# Altium schematic sheet BT8670.SchDoc: BULLSEYE
size A3; CompanyName: TYMPHANY; DrawnBy: Yetta.He; Organization: PABU; Address1: 11F,block A, CEC building,; Address2: No.2070 Shennan Zhong road,; Address3: Huaqiang North, Futian District,; Address4: Shenzhen,  Guang Dong, P.R.C 518000; DocumentNumber: 6; Revision: 0.0.5; SheetNumber: 6; SheetTotal: 7; Size: A3; Status: DP1
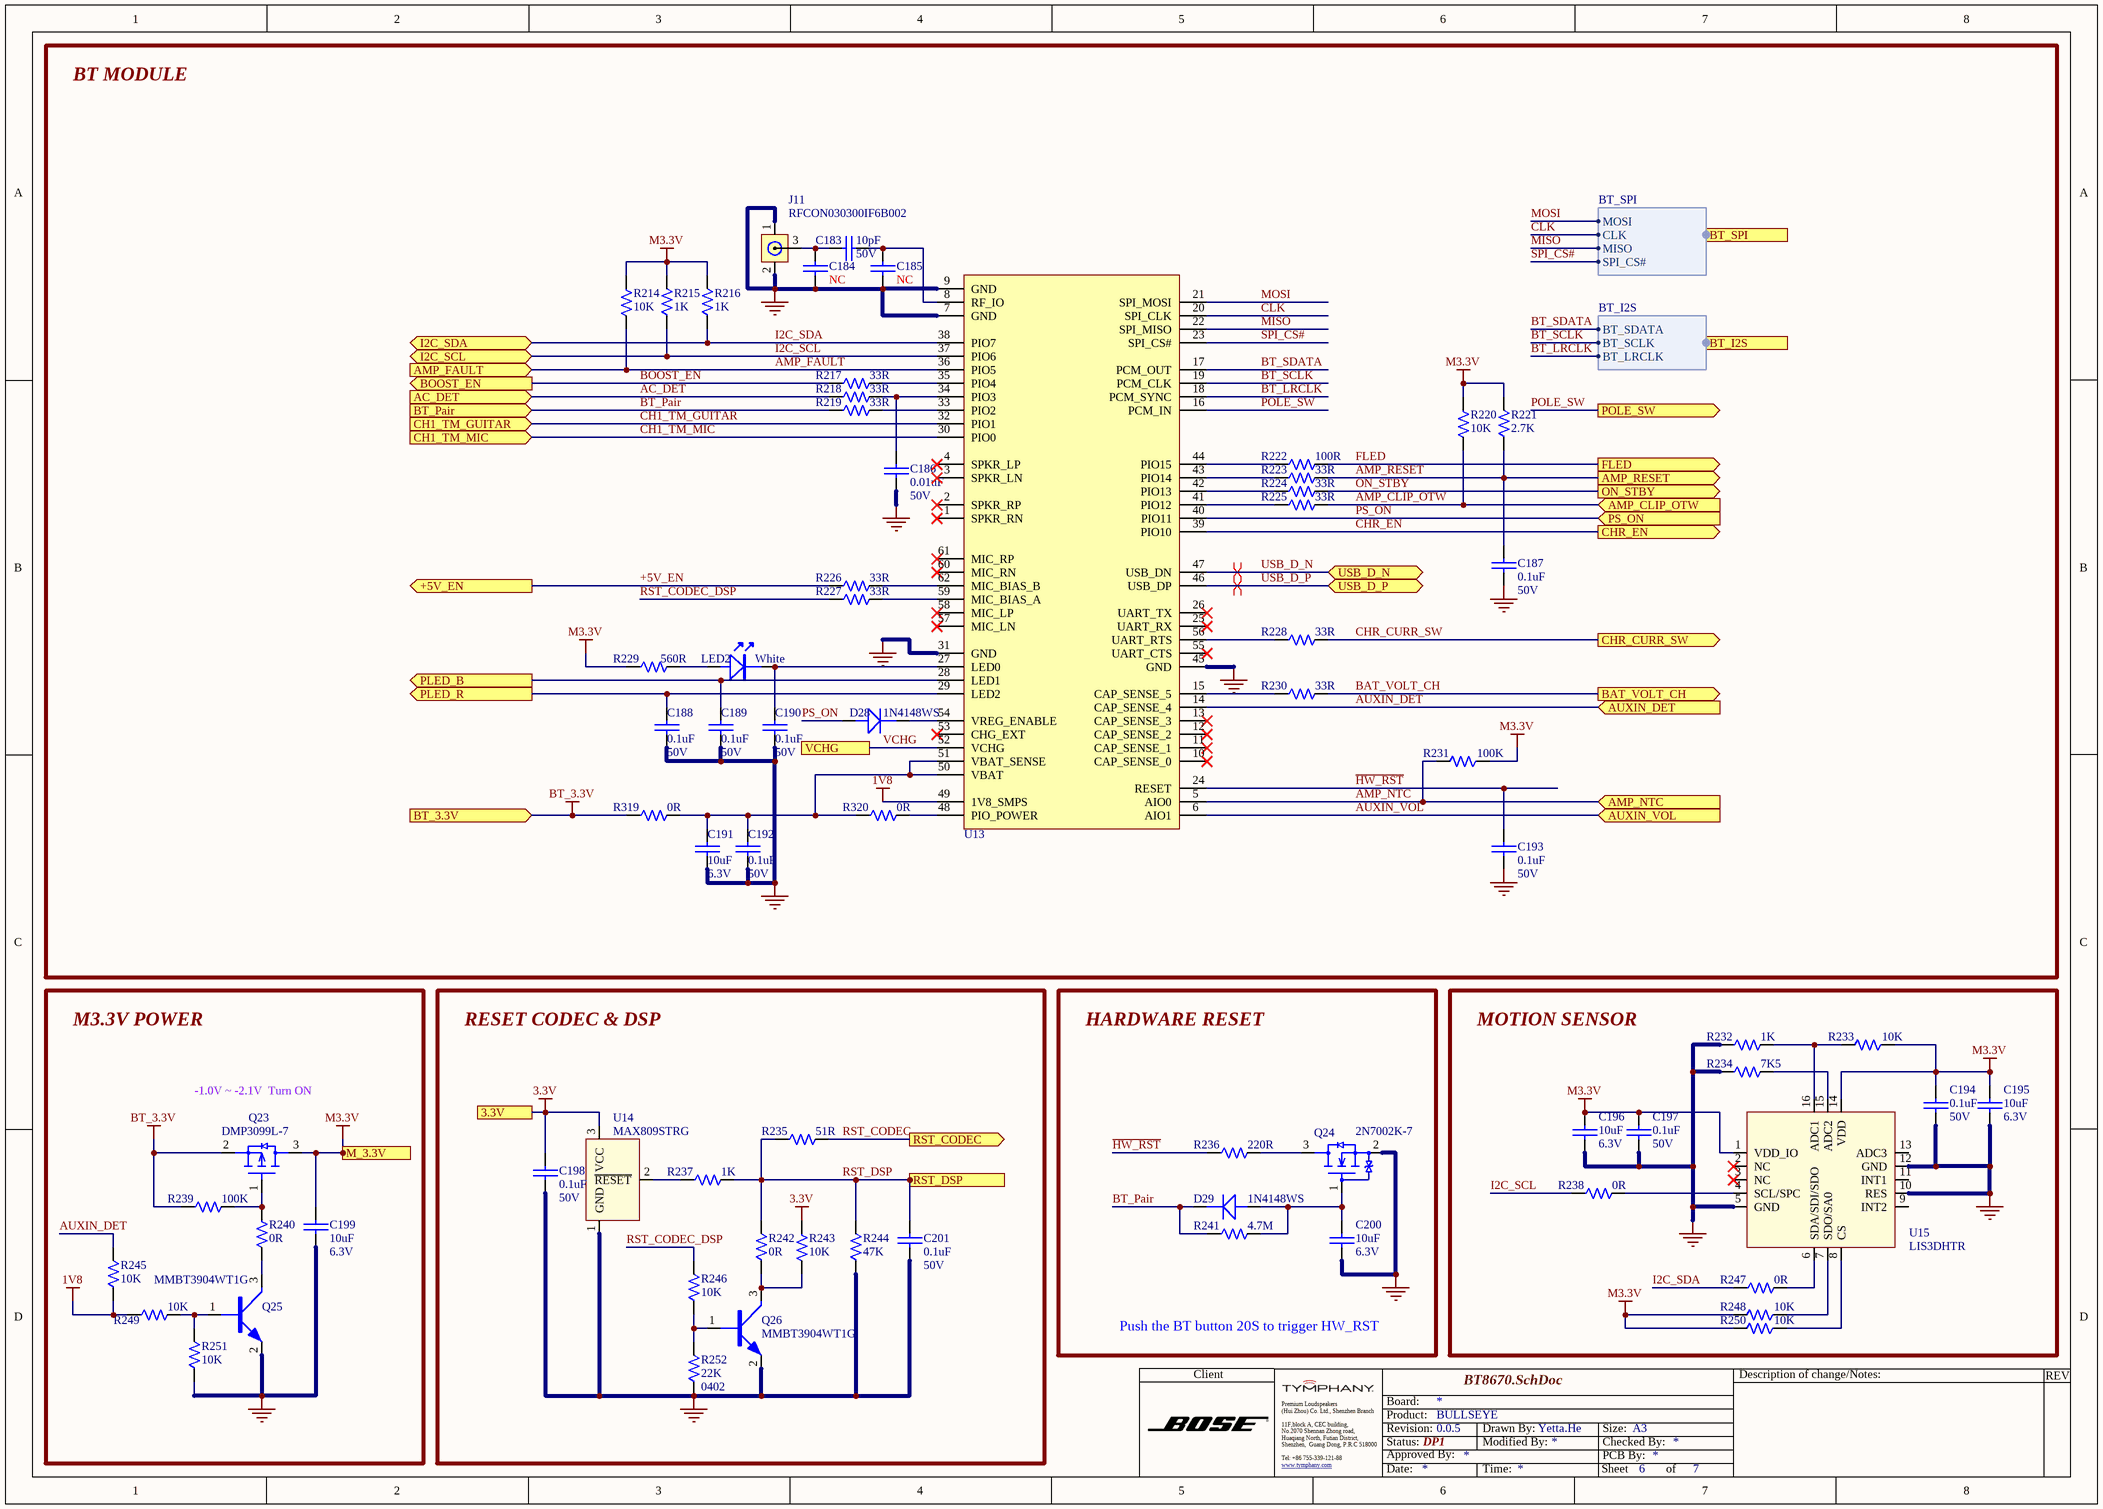
[diagram p0: BT8670.SchDoc]

## Parts
C183  value 10pF  Voltage: 50V  [CAPC0402-RW]  (hidden comment: PWL410371-1000)
C184  value NC  [CAPC0402-RW]  (hidden comment: CAP0402 NC)
C185  value NC  [CAPC0402-RW]  (hidden comment: CAP0402 NC)
C186  value 0.01uF  Voltage: 50V  [CAPC0402-RW]  (hidden comment: PWL456470-1030)
C187  value 0.1uF  Voltage: 50V  [CAPC0402-RW]  (hidden comment: PWL456470-1040)
C188  value 0.1uF  Voltage: 50V  [CAPC0402-RW]  (hidden comment: PWL456470-1040)
C189  value 0.1uF  Voltage: 50V  [CAPC0402-RW]  (hidden comment: PWL456470-1040)
C190  value 0.1uF  Voltage: 50V  [CAPC0402-RW]  (hidden comment: PWL456470-1040)
C191  value 10uF  Voltage: 6.3V  [CAPC0603-RW]  (hidden comment: T54502106710E)
C192  value 0.1uF  Voltage: 50V  [CAPC0402-RW]  (hidden comment: PWL456470-1040)
C193  value 0.1uF  Voltage: 50V  [CAPC0402-RW]  (hidden comment: PWL456470-1040)
C194  value 0.1uF  Voltage: 50V  [CAPC0402-RW]  (hidden comment: PWL456470-1040)
C195  value 10uF  Voltage: 6.3V  [CAPC0603-RW]  (hidden comment: T54502106710E)
C196  value 10uF  Voltage: 6.3V  [CAPC0603-RW]  (hidden comment: T54502106710E)
C197  value 0.1uF  Voltage: 50V  [CAPC0402-RW]  (hidden comment: PWL456470-1040)
C198  value 0.1uF  Voltage: 50V  [CAPC0402-RW]  (hidden comment: PWL456470-1040)
C199  value 10uF  Voltage: 6.3V  [CAPC0603-RW]  (hidden comment: T54502106710E)
C200  value 10uF  Voltage: 6.3V  [CAPC0603-RW]  (hidden comment: T54502106710E)
C201  value 0.1uF  Voltage: 50V  [CAPC0402-RW]  (hidden comment: PWL456470-1040)
D28  RCD114148-0020  [SOD-323]  (value not drawn)
D29  RCD114148-0020  [SOD-323]  (value not drawn)
J11  MFG Part: RFCON030300IF6B002  [RF IPEXSOCKET RFCON030300IF6B00]  (hidden comment: T690300090900)
LED2  Color: White  [LED0603_WHITE]  (hidden comment: T575006150202)
Q23  T585002550438  [SOT23-132-RW]  (value not drawn)
Q24  T586003230438  [SOT23-132-RW]  (value not drawn)
Q25  T581004222440  [SOT323(SC-70)-R]  (value not drawn)
Q26  T581004222440  [SOT323(SC-70)-R]  (value not drawn)
R214  value 10K  [0402-RW]  (hidden comment: QCF161240-1002)
R215  value 1K  [0402-RW]  (hidden comment: QCF161240-1001)
R216  value 1K  [0402-RW]  (hidden comment: QCF161240-1001)
R217  value 33R  [0402-RW]  (hidden comment: QCF161241-3309)
R218  value 33R  [0402-RW]  (hidden comment: QCF161241-3309)
R219  value 33R  [0402-RW]  (hidden comment: QCF161241-3309)
R220  value 10K  [0402-RW]  (hidden comment: QCF161240-1002)
R221  value 2.7K  [0402-RW]  (hidden comment: QCF161240-2701)
R222  value 100R  [0603-RW]  (hidden comment: QCF011030-1000)
R223  value 33R  [0402-RW]  (hidden comment: QCF161241-3309)
R224  value 33R  [0402-RW]  (hidden comment: QCF161241-3309)
R225  value 33R  [0402-RW]  (hidden comment: QCF161241-3309)
R226  value 33R  [0402-RW]  (hidden comment: QCF161241-3309)
R227  value 33R  [0402-RW]  (hidden comment: QCF161241-3309)
R228  value 33R  [0402-RW]  (hidden comment: QCF161241-3309)
R229  value 560R  [0603-RW]  (hidden comment: QCF011030-5600)
R230  value 33R  [0402-RW]  (hidden comment: QCF161241-3309)
R231  value 100K  [0603-RW]  (hidden comment: QCF011030-1003)
R232  value 1K  [0402-RW]  (hidden comment: QCF161240-1001)
R233  value 10K  [0402-RW]  (hidden comment: QCF161240-1002)
R234  value 7K5  [0603-RW]  (hidden comment: QCF011030-7501)
R235  value 51R  [0402-RW]  (hidden comment: QCF161240-5109)
R236  value 220R  [0402-RW]  (hidden comment: QCF161240-2200)
R237  value 1K  [0603-RW]  (hidden comment: QCF011030-1001)
R238  value 0R  [0603-RW]  (hidden comment: T502000002009)
R239  value 100K  [0603-RW]  (hidden comment: QCF011030-1003)
R240  value 0R  [0603-RW]  (hidden comment: T502000002009)
R241  value 4.7M  [0603-RW]  (hidden comment: QCF011030-4704)
R242  value 0R  [0603-RW]  (hidden comment: T502000002009)
R243  value 10K  [0402-RW]  (hidden comment: QCF161240-1002)
R244  value 47K  [0603-RW]  (hidden comment: QCF011030-4702)
R245  value 10K  [0402-RW]  (hidden comment: QCF161240-1002)
R246  value 10K  [0402-RW]  (hidden comment: QCF161240-1002)
R247  value 0R  [0603-RW]  (hidden comment: T502000002009)
R248  value 10K  [0402-RW]  (hidden comment: QCF161240-1002)
R249  value 10K  [0402-RW]  (hidden comment: QCF161240-1002)
R250  value 10K  [0402-RW]  (hidden comment: QCF161240-1002)
R251  value 10K  [0402-RW]  (hidden comment: QCF161240-1002)
R252  value 22K  PACKAGE: 0402  [0402-RW]  (hidden comment: QCF161240-2202)
R319  value 0R  [0603-RW]  (hidden comment: T502000002009)
R320  value 0R  [0603-RW]  (hidden comment: T502000002009)
U13  WPCA00101-X001/0001  [BTM-865]  (value not drawn)
U14  MFG Part: MAX809STRG  [SOT23-132-SW]  (hidden comment: T610300090588)
U15  T611100028639  [LGA-16]  (value not drawn)

## Blocks framed on the sheet
BT MODULE: C183-C193 D28 J11 LED2 R214-R231 R319 R320 U13
M3.3V POWER: C199 Q23 Q25 R239 R240 R245 R249 R251
RESET CODEC & DSP: C198 C201 Q26 R235 R237 R242-R244 R246 R252 U14
HARDWARE RESET: C200 D29 Q24 R236 R241
MOTION SENSOR: C194-C197 R232-R234 R238 R247 R248 R250 U15

## Ports
3.3V, +5V_EN (out), AC_DET (in), AMP_CLIP_OTW (in), AMP_FAULT (in), AMP_NTC (in), AMP_RESET (out), AUXIN_DET (in), AUXIN_VOL (in), BAT_VOLT_CH (out), BOOST_EN (out), BT_3.3V (in), BT_I2S (out, harness BT_I2S), BT_Pair (in), BT_SPI (in, harness BT_SPI), CH1_TM_GUITAR (in), CH1_TM_MIC (in), CHR_CURR_SW (out), CHR_EN (out), FLED (out), I2C_SCL (bidir), I2C_SDA (bidir), M_3.3V (out), ON_STBY (out), PLED_B (out), PLED_R (out), POLE_SW (out), PS_ON (in), RST_CODEC (out), RST_DSP (out), USB_D_N (bidir), USB_D_P (bidir), VCHG

## Harnesses
BT_SPI: MOSI, CLK, MISO, SPI_CS#
BT_I2S: BT_SDATA, BT_SCLK, BT_LRCLK

## Nets
1V8: R245.1 R249.1 U13.49(1V8_SMPS)
3.3V: C198.1 R243.1 U14.3(VCC) ; port 3.3V
BT_3.3V: Q23.2(S) R239.1 R319.1 ; port BT_3.3V
GND: C184.2 C185.2 C186.1 C187.2 C188.2 C189.2 C190.2 C191.2 C192.2 C193.2 C194.2 C195.2 C196.2 C197.2 C198.2 C199.2 C200.2 C201.2 J11.1(GND) J11.2(GND) Q24.2(S) Q25.2(E) Q26.2(E) R232.1 R234.1 R244.1 R251.1 R252.1 U13.7(GND) U13.9(GND) U13.31(GND) U13.45(GND) U14.1(GND) U15.5(GND) U15.10(RES) U15.12(GND)
M3.3V: C194.1 C195.1 C196.1 C197.1 C199.1 Q23.3(D) R214.1 R215.2 R216.2 R220.1 R221.2 R229.1 R231.1 R233.1 R248.2 R250.2 U15.1(VDD_IO) U15.14(VDD) ; port M_3.3V
+5V_EN: R226.1 ; port +5V_EN
AC_DET: R218.1 ; port AC_DET
AMP_CLIP_OTW: R220.2 R225.2 ; port AMP_CLIP_OTW
AMP_FAULT: R214.2 U13.36(PIO5) ; port AMP_FAULT
AMP_NTC: R231.2 U13.5(AIO0) ; port AMP_NTC
AMP_RESET: C187.1 R221.1 R223.2 ; port AMP_RESET
AUXIN_DET: R245.2 U13.14(CAP_SENSE_4) ; port AUXIN_DET
AUXIN_VOL: U13.6(AIO1) ; port AUXIN_VOL
BAT_VOLT_CH: R230.2 ; port BAT_VOLT_CH
BOOST_EN: R217.1 ; port BOOST_EN
BT_LRCLK: U13.18(PCM_SYNC) ; port BT_I2S.BT_LRCLK
BT_Pair: D29.2(K) R219.1 R241.1 ; port BT_Pair
BT_SCLK: U13.19(PCM_CLK) ; port BT_I2S.BT_SCLK
BT_SDATA: U13.17(PCM_OUT) ; port BT_I2S.BT_SDATA
CH1_TM_GUITAR: U13.32(PIO1) ; port CH1_TM_GUITAR
CH1_TM_MIC: U13.30(PIO0) ; port CH1_TM_MIC
CHR_CURR_SW: R228.2 ; port CHR_CURR_SW
CHR_EN: U13.39(PIO10) ; port CHR_EN
CLK: U13.20(SPI_CLK) ; port BT_SPI.CLK
FLED: R222.2 ; port FLED
~{HW_RST}: C193.1 R236.1 U13.24(RESET)
I2C_SCL: R215.1 R238.1 U13.37(PIO6) ; port I2C_SCL
I2C_SDA: R216.1 R247.1 U13.38(PIO7) ; port I2C_SDA
MISO: U13.22(SPI_MISO) ; port BT_SPI.MISO
MOSI: U13.21(SPI_MOSI) ; port BT_SPI.MOSI
ON_STBY: R224.2 ; port ON_STBY
PLED_B: C189.1 U13.28(LED1) ; port PLED_B
PLED_R: C188.1 U13.29(LED2) ; port PLED_R
POLE_SW: U13.16(PCM_IN) ; port POLE_SW
PS_ON: D28.1(A) U13.40(PIO11) ; port PS_ON
RST_CODEC: R235.2 ; port RST_CODEC
RST_CODEC_DSP: R227.1 R246.2
RST_DSP: C201.1 R235.1 R237.2 R242.2 R244.2 ; port RST_DSP
SPI_CS#: U13.23(SPI_CS#) ; port BT_SPI.SPI_CS#
USB_D_N: U13.47(USB_DN) ; port USB_D_N
USB_D_P: U13.46(USB_DP) ; port USB_D_P
VCHG: U13.52(VCHG) ; port VCHG
NetC183_1: C183.1 C184.1 J11.3
NetC183_2: C183.2 C185.1 U13.8(RF_IO)
NetC186_2: C186.2 R218.2 U13.34(PIO3)
NetC190_1: C190.1 LED2.2(K) U13.27(LED0)
NetC191_1: C191.1 C192.1 R319.2 R320.1 U13.50(VBAT) U13.51(VBAT_SENSE)
NetC200_1: C200.1 D29.1(A) Q24.1(G) R241.2
NetD28_2: D28.2(K) U13.54(VREG_ENABLE)
NetLED2_1: LED2.1(A) R229.2
NetQ23_1: Q23.1(G) R239.2 R240.1
NetQ24_3: Q24.3(D) R236.2
NetQ25_1: Q25.1(B) R249.2 R251.2
NetQ25_3: Q25.3(C) R240.2
NetQ26_1: Q26.1(B) R246.1 R252.2
NetQ26_3: Q26.3(C) R242.1 R243.2
NetR217_2: R217.2 U13.35(PIO4)
NetR219_2: R219.2 U13.33(PIO2)
NetR222_1: R222.1 U13.44(PIO15)
NetR223_1: R223.1 U13.43(PIO14)
NetR224_1: R224.1 U13.42(PIO13)
NetR225_1: R225.1 U13.41(PIO12)
NetR226_2: R226.2 U13.62(MIC_BIAS_B)
NetR227_2: R227.2 U13.59(MIC_BIAS_A)
NetR228_1: R228.1 U13.56(UART_RTS)
NetR230_1: R230.1 U13.15(CAP_SENSE_5)
NetR232_2: R232.2 R233.2 U15.16(ADC1)
NetR234_2: R234.2 U15.15(ADC2)
NetR237_1: R237.1 U14.2(~{RESET})
NetR238_2: R238.2 U15.4(SCL/SPC)
NetR247_2: R247.2 U15.6(SDA/SDI/SDO)
NetR248_1: R248.1 U15.7(SDO/SA0)
NetR250_1: R250.1 U15.8(CS)
NetR320_2: R320.2 U13.48(PIO_POWER)

Not connected (* = marked no-connect by the designer): U13 1(SPKR_RN)* 2(SPKR_RP)* 3(SPKR_LN)* 4(SPKR_LP)* 10(CAP_SENSE_0)* 11(CAP_SENSE_1)* 12(CAP_SENSE_2)* 13(CAP_SENSE_3)* 25(UART_RX)* 26(UART_TX)* 53(CHG_EXT)* 55(UART_CTS)* 57(MIC_LN)* 58(MIC_LP)* 60(MIC_RN)* 61(MIC_RP)*; U15 2(NC)* 3(NC)* 9(INT2) 11(INT1) 13(ADC3)

## Layout directives
differential pair: USB_D_N, USB_D_P

## Notes on the sheet
- -1.0V ~ -2.1V  Turn ON
- Push the BT button 20S to trigger HW_RST
- Client
- Description of change/Notes:
- REV
- Premium Loudspeakers
- (Hui Zhou) Co. Ltd., Shenzhen Branch
- Tel: +86 755-339-121-88
- Board:
- Status:
- Revision:
- Product:
- Approved By:
- Drawn By:
- Modified By:
- Checked By:
- PCB By:
- Size:
- www.tymphany.com <http://www.tymphany.com>
- Date:
- Time:
- Sheet
- of

## Library data of the parts
C183 = CAP0402 10pF 50V 5%: CHIP CAP 5% 50V 0402 NPO 10pF; SAP: T541011006508; Type: Capacitor; CREATE_NAME: TOM@Deftronics; DIP&SMD: SMD; PACKAGE: CAPC0402; Vendor Code: *; Vendor Name: *; MFG: *; MFG Part: *; Other: *; Tolerance: 5%; CREATE_TIME: 06-Aug-2013; Customer Specific: N/A
C184 C185 = CAP0402 NC: NC; Type: Capacitor; CREATE_NAME: Tom; DIP&SMD: SMD; SAP: *; PACKAGE: CAPC0402; Vendor Code: *; Vendor Name: *; MFG: *; MFG Part: *; Other: *; Tolerance: *; CREATE_TIME: 18-Mar-2016; Voltage: *; Customer Specific: N/A
C186 = CAP0402 0.01uF 50V 10%: CAP, CER, 0.01uF, 10%, 50V, X7R, 0402, RoHS; SAP: T542011037508; Type: Capacitor; CREATE_NAME: Evan@Deftronics; DIP&SMD: SMD; PACKAGE: CAPC0402; Vendor Name: *; MFG: *; MFG Part: *; Other: X7R; Tolerance: 10%; CREATE_TIME: 26-May-2014; Customer Specific: N/A
C187-C190 C192-C194 C197 C198 C201 = CAP0402 0.1uF 50V 10%: CAP X7R .10UF 50V +-10% 0402 WALSIN L; SAP: T542011047508; Tolerance: 10%; Type: Capacitor; CREATE_NAME: TOM@Deftronics; DIP&SMD: SMD; PACKAGE: CAPC0402; Vendor Name: *; MFG: *; MFG Part: *; Other: X7R; CREATE_TIME: 13-May-2014; Customer Specific: N/A
C191 C195 C196 C199 C200 = CAP0603 10uF 6.3V 10%_X5R_SAMSUNG: CAP X5R 10UF 6.3V +-10% 0603 SAMSUN L; MFG Part: CL10A106KQ8NNNC; Tolerance: 10%; Type: Capacitor; CREATE_NAME: Nathan; DIP&SMD: SMD; SAP: T54502106710E; PACKAGE: CAPC0603; Vendor Code: *; Vendor Name: *; MFG: SAMSUNG; Other: X5R; CREATE_TIME: 30-Oct-2018; Customer Specific: N/A
D28 D29 = 1N4148WS: DIODE SW 1N4148 VF=0.7V SOD-323; MFG: TW SEMICONDUCTOR; SAP: T572005070208; Voltage: 100V; Current: 150MA; Vendor Name: *; Vendor Code: *; Type: DIODE; Package: SOD-323; MFG Part: 1N4148WS
J11 = RF IPEXSOCKET RFCON030300IF6B00: CONN RF IPEXSOCKET WALSIN 3.1*3.0*1.25 K; CREATE_NAME: Nathan; DIP&SMD: SMD; Vendor Code: *; Vendor Name: *; MFG: WALSIN; TYPE: Connector; CREATE_TIME: 27-Dec-2017; SAP: T690300090900
LED2 = LED0603W_19-217-T1D-AQRHY-3T: LED WHI 0603 19-217-T1D-A EVERLIGH K; MFG: EVERLIGHT(億光); Creat Name: Nathan; MFG Part: 19-217-T1D-AQRHY-3T; SAP: T575006150202; Package: 0603; Vendor Code: *; Vendor Name: *; Type: LED; Creat Time: 25-OCT-2016
Q23 = DMP3099L-7: PMOS 20V DMP3099L-7 SOT23 DIODES K; MFG: DIODES  (ZETEX); CREATE_NAME: Nathan; DIP&SMD: SMD; SAP: T585002550438; Vendor Code: *; Vendor Name: *; Power: *; Voltage: *; Type: PMOS; Package: SOT-23; CREATE_TIME: 25-Nov-2018; Customer Specific: N/A; MFG Part: DMP3099L-7
Q24 = 2N7002K-7: NMOS 60V 2N7002K-7 SOT23 DIODES K; MFG: DIODES  (ZETEX); Type: N-CHANNEL MOSFET; CREATE_NAME: Nathan; DIP&SMD: SMD; SAP: T586003230438; Power: *; Vendor Code: *; Vendor Name: *; Voltage: 60V; Package: SOT-23; MFG Part: 2N7002K-7; CREATE_TIME: 27-Sep-2018; Customer Specific: N/A
Q25 Q26 = MMBT3904WT1G: NPN 40V MMBT3904WT1G SC70 ( ON K; CREATE_NAME: Nathan; DIP&SMD: SMD; SAP: T581004222440; MFG: ON; Vendor Code: *; Vendor Name: *; Voltage: *; Type: NPN; CREATE_TIME: 11-Mar-2019; Current: *; MFG Part: MMBT3904WT1G; Customer Specific: N/A
R214 R220 R233 R243 R245 R246 R248-R251 = RES0402 1/16W 1% 10K OHM: CHIP RES 10K OHM 1/16W 1% 0402; SAP: T502100201399; MFG: WALSIN; DIP&SMD: SMD; Vendor Code: *; Power: 1/16W; Vendor Name: *; MFG Part: *; TOL: 1%; Type: Resistor; PACKAGE: 0402; Customer Specific: N/A
R215 R216 R232 = RES0402 1/16W 1% 1K OHM: CHIP RES 1K OHM 1/16W 1% 0402; SAP: T502100101399; MFG: WALSIN; DIP&SMD: SMD; Vendor Code: *; Power: 1/16W; Vendor Name: *; MFG Part: *; TOL: 1%; Type: Resistor; PACKAGE: 0402; Customer Specific: N/A
R217-R219 R223-R228 R230 = RES0402 1/16W 1% 33 OHM: CHIP RES 33 OHM 1/16W 1% 0402; SAP: T502330A01399; MFG: WALSIN; DIP&SMD: SMD; Vendor Code: *; Power: 1/16W; Vendor Name: *; MFG Part: *; TOL: 1%; Type: Resistor; PACKAGE: 0402; Customer Specific: N/A
R221 = RES0402 1/16W 1% 2.7K OHM: CHIP RES 2.7K OHM 1/16W 1% 0402; SAP: T502270101399; MFG: WALSIN; DIP&SMD: SMD; Vendor Code: *; Power: 1/16W; Vendor Name: *; MFG Part: *; TOL: 1%; Type: Resistor; PACKAGE: 0402; Customer Specific: N/A
R222 = RES0603 1/10W 1% 100 OHM: CHIP 100 OHM 100PPM +-1% 0603 WALS L; Vendor Code: 10010262; SAP: T502100002399; Power: 1/10W; Vendor Name: 东莞市晴远电子有限公司; MFG: WALSIN (華新); TOL: 1%; DIP&SMD: SMD; MFG Part: *; Type: Resistor; PACKAGE: 0603; Customer Specific: N/A
R229 = RES0603 1/10W 1% 560 OHM: GP CHIP RES. 560 OHM 1/10W 1% 0603; Vendor Code: 10010262; SAP: T502560002399; Vendor Name: 东莞市晴远电子有限公司; Power: *; MFG Part: *; MFG: *; TOL: 1%; Type: Resistor; PACKAGE: 0603
R231 R239 = RES0603 1/10W 1% 100K OHM: GP CHIP RES. 100K OHM 1/10W 1% 0603; Vendor Code: 10010262; SAP: T502100302399; Vendor Name: 东莞市晴远电子有限公司; DIP&SMD: SMD; Power: 1/10W; MFG Part: *; MFG: *; TOL: 1%; Type: Resistor; PACKAGE: 0603; Customer Specific: N/A
R234 = RES0603 1/10W 1% 7.5K OHM: CHIP RES 7.5K OHM 1/10W 1% 0603; SAP: T502750102399; Vendor Code: 10010262; Vendor Name: 东莞市晴远电子有限公司; CREATE_NAME: Nathan; DIP&SMD: SMD; PACKAGE: 0603; TOL: 1%; MFG Part: *; MFG: *; Type: Resistor; Power: 1/10W; CREATE_TIME: 26-NOV-2014; Customer Specific: N/A
R235 = RES0402 1/16W 1% 51 OHM: CHIP RES  51 OHM 1/16W 1% 0402; SAP: T502510A01399; CREATE_NAME: GordonL@Deftronics; Vendor Code: *; Power: 1/16W; Vendor Name: *; MFG Part: *; MFG: *; TOL: 1%; CREATE_TIME: 05-Jan-2013; Type: Resistor; PACKAGE: 0402
R236 = RES0402 1/16W 1% 220 OHM: CHIP RES 220 OHM 1/16W 1% 0402; SAP: T502220001399; MFG: WALSIN; Vendor Code: *; Power: *; Vendor Name: *; MFG Part: *; TOL: 1%; Type: Resistor; PACKAGE: 0402
R237 = RES0603 1/10W 1% 1K OHM: GP CHIP RES. 1K OHM 1/10W 1% 0603; Vendor Code: 10010262; SAP: T502100102399; Vendor Name: 东莞市晴远电子有限公司; Power: *; MFG: *; MFG Part: *; TOL: 1%; Type: Resistor; PACKAGE: 0603
R238 R240 R247 R319 R320 = RES0603 1/10W 0 OHM_WALSIN: CHIP 0 OHM 0 OHM 0 OHM 0603 WALSIN L; MFG Part: WR06X000PTL; Power: 1/10W; MFG: WALSIN (華新); DIP&SMD: SMD; Vendor Code: *; SAP: T502000002009; Vendor Name: *; TOL: *; Type: Resistor; PACKAGE: 0603; Customer Specific: N/A
R241 = RES0603 1/10W 1% 4.7M OHM: CHIP RES 4.7M OHM 1/10W 1% 0603; Vendor Code: 10010262; SAP: T502470402399; Vendor Name: 东莞市晴远电子有限公司; Power: *; MFG Part: *; MFG: *; TOL: 1%; Type: Resistor; PACKAGE: 0603
R242 = RES0603 1/10W 0 OHM_WALSIN: CHIP 0 OHM 0 OHM 0 OHM 0603 WALSIN L; MFG Part: WR06X000PTL; MFG: WALSIN (華新); Vendor Code: *; SAP: T502000002009; Power: *; Vendor Name: *; TOL: *; Type: Resistor; PACKAGE: 0603
R244 = RES0603 1/10W 1% 47K OHM: GP CHIP RES. 47K OHM 1/10W 1% 0603; Vendor Code: 10010262; SAP: T502470202399; Vendor Name: 东莞市晴远电子有限公司; DIP&SMD: SMD; Power: 1/10W; MFG Part: *; MFG: *; TOL: 1%; Type: Resistor; PACKAGE: 0603; Customer Specific: N/A
R252 = RES0402 1/16W 1% 22K OHM: CHIP RES 22K OHM 1/16W 1% 0402; SAP: T502220201399; MFG: WALSIN; Vendor Code: *; Power: *; Vendor Name: *; MFG Part: *; TOL: 1%; Type: Resistor
U13 = BTM865_BOSE CHIBI: BOSE CHIBI BT F/W V1.0 CHIBI K; MFG Part: BTM865; SAP: T910600000630; MFG: RAYSON; CREATE_NAME: Nathan; DIP&SMD: SMT;PCB; Vendor Code: *; Vendor Name: *; CREATE_TIME: 12-Sep-2017; Type: BLUETOOTH
U14 = MAX809STRG_ON SEMI: MCU MAX809STRG SOT23-3 ON SEMI G; MFG: ON SEMI; CREASE_NAME: TOM@Deftronics; SAP: T610300090588; Vendor Code: *; Vendor Name: *; Type: IC; CREASE_TIME: 4-JULY-2013
U15 = LIS3DHTR: A\D LIS3DHTR LGA-16 ST K; CREATE_NAME: Nathan; DIP&SMD: SMD; MFG: ST; Vendor Code: *; Vendor Name: *; SAP: T611100028639; Type: IC; CREATE_TIME: 10-Mar-2019; Customer Specific: N/A; MFG Part: LIS3DHTR